# Altium schematic sheet NET.SchDoc
size A4
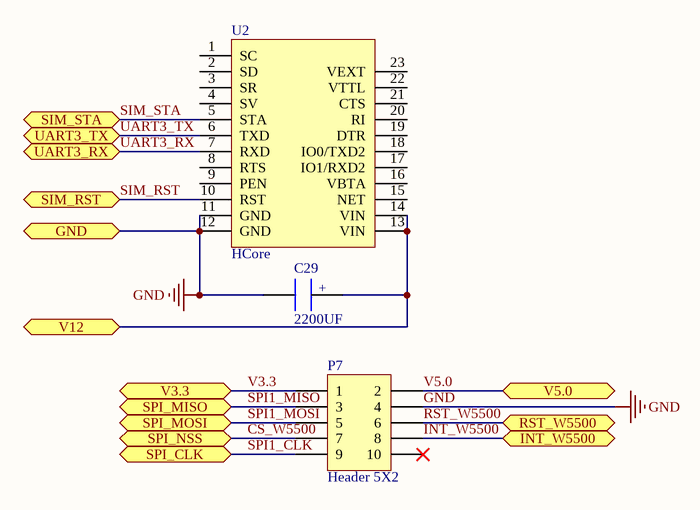
[diagram p0: NET.SchDoc]

## Parts
C29  2200UF  [8X12_CAP]
P7  Header 5X2  [HDR2X5]
U2  HCore  [HCore]

## Ports
GND, INT_W5500, RST_W5500, SIM_RST, SIM_STA, SPI_CLK, SPI_MISO, SPI_MOSI, SPI_NSS, UART3_RX, UART3_TX, V3.3, V5.0, V12

## Nets
GND: C29.2 P7.4 U2.11(GND) U2.12(GND) ; port GND
CS_W5500: P7.7 ; port SPI_NSS
INT_W5500: P7.8 ; port INT_W5500
RST_W5500: P7.6 ; port RST_W5500
SIM_RST: U2.10(RST) ; port SIM_RST
SIM_STA: U2.5(STA) ; port SIM_STA
SPI1_CLK: P7.9 ; port SPI_CLK
SPI1_MISO: P7.3 ; port SPI_MISO
SPI1_MOSI: P7.5 ; port SPI_MOSI
UART3_RX: U2.7(RXD) ; port UART3_RX
UART3_TX: U2.6(TXD) ; port UART3_TX
V3.3: P7.1 ; port V3.3
V5.0: P7.2 ; port V5.0
V12: C29.1 U2.13(VIN) U2.14(VIN) ; port V12

Not connected (* = marked no-connect by the designer): P7 10*; U2 1(SC) 2(SD) 3(SR) 4(SV) 8(RTS) 9(PEN) 15(NET) 16(VBTA) 17(IO1/RXD2) 18(IO0/TXD2) 19(DTR) 20(RI) 21(CTS) 22(VTTL) 23(VEXT)

## Notes on the sheet
- (in symbol CAP) +

## Library data of the parts
C29 = CAP
P7 = Header 5X2: Header, 5-Pin, Dual row; LatestRevisionDate: 17-Jul-2002; LatestRevisionNote: Re-released for DXP Platform.; Publisher: Altium Limited